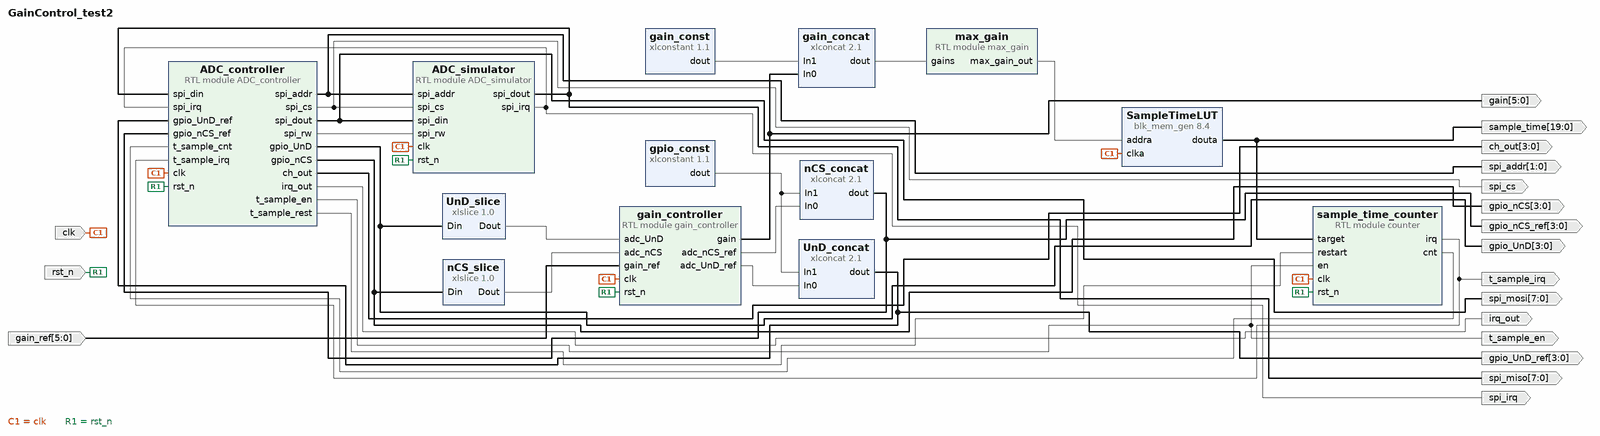
[diagram p0: block diagram of the top level]
# Vivado block design GainControl_test2, xczu3eg-sbva484-1-i, Vivado 2020.2
create_bd_design GainControl_test2

create_bd_port -dir O -from 3 -to 0 ch_out
create_bd_port -dir I -type clk clk
create_bd_port -dir O -from 5 -to 0 gain
create_bd_port -dir I -from 5 -to 0 gain_ref
create_bd_port -dir O -from 3 -to 0 gpio_UnD
create_bd_port -dir O -from 3 -to 0 gpio_UnD_ref
create_bd_port -dir O -from 3 -to 0 gpio_nCS
create_bd_port -dir O -from 3 -to 0 gpio_nCS_ref
create_bd_port -dir O irq_out
create_bd_port -dir I -type rst rst_n
create_bd_port -dir O -from 19 -to 0 sample_time
create_bd_port -dir O -from 1 -to 0 spi_addr
create_bd_port -dir O spi_cs
create_bd_port -dir O spi_irq
create_bd_port -dir O -from 7 -to 0 spi_miso
create_bd_port -dir O -from 7 -to 0 -type data spi_mosi
create_bd_port -dir O t_sample_en
create_bd_port -dir O t_sample_irq

create_bd_cell -type ip -vlnv xilinx.com:ip:blk_mem_gen:8.4 SampleTimeLUT
set_property -dict [list \
  CONFIG.Coe_File ../../../../../../../../src/sample_time_lut_data.coe \
  CONFIG.Enable_32bit_Address false \
  CONFIG.Enable_A Always_Enabled \
  CONFIG.Fill_Remaining_Memory_Locations true \
  CONFIG.Load_Init_File true \
  CONFIG.Memory_Type Single_Port_ROM \
  CONFIG.Port_A_Write_Rate 0 \
  CONFIG.Register_PortA_Output_of_Memory_Primitives true \
  CONFIG.Remaining_Memory_Locations F \
  CONFIG.Use_RSTA_Pin false \
  CONFIG.Write_Depth_A 64 \
  CONFIG.Write_Width_A 20 \
  CONFIG.use_bram_block Stand_Alone \
] [get_bd_cells SampleTimeLUT]
create_bd_cell -type ip -vlnv xilinx.com:ip:xlconcat:2.1 UnD_concat
set_property -dict {CONFIG.IN1_WIDTH 3 CONFIG.NUM_PORTS 2} [get_bd_cells UnD_concat]
create_bd_cell -type ip -vlnv xilinx.com:ip:xlslice:1.0 UnD_slice
set_property -dict {CONFIG.DIN_WIDTH 4} [get_bd_cells UnD_slice]
create_bd_cell -type ip -vlnv xilinx.com:ip:xlconcat:2.1 gain_concat
set_property -dict {CONFIG.IN0_WIDTH 6 CONFIG.IN1_WIDTH 18 CONFIG.NUM_PORTS 2} [get_bd_cells gain_concat]
create_bd_cell -type ip -vlnv xilinx.com:ip:xlconstant:1.1 gain_const
set_property -dict {CONFIG.CONST_VAL 0 CONFIG.CONST_WIDTH 18} [get_bd_cells gain_const]
create_bd_cell -type module -reference gain_controller gain_controller
create_bd_cell -type ip -vlnv xilinx.com:ip:xlconstant:1.1 gpio_const
set_property -dict {CONFIG.CONST_VAL 0 CONFIG.CONST_WIDTH 3} [get_bd_cells gpio_const]
create_bd_cell -type module -reference max_gain max_gain
create_bd_cell -type ip -vlnv xilinx.com:ip:xlconcat:2.1 nCS_concat
set_property -dict {CONFIG.IN1_WIDTH 3 CONFIG.NUM_PORTS 2} [get_bd_cells nCS_concat]
create_bd_cell -type ip -vlnv xilinx.com:ip:xlslice:1.0 nCS_slice
set_property -dict {CONFIG.DIN_WIDTH 4} [get_bd_cells nCS_slice]
create_bd_cell -type module -reference counter sample_time_counter
set_property -dict {CONFIG.n_bits 20} [get_bd_cells sample_time_counter]
create_bd_cell -type module -reference ADC_controller ADC_controller
create_bd_cell -type module -reference ADC_simulator ADC_simulator

# ---- connections ----

connect_bd_net -net ADC_controller_0_ch_out [get_bd_pins ADC_controller/ch_out] [get_bd_ports ch_out]
connect_bd_net -net ADC_controller_0_gpio_UnD [get_bd_pins ADC_controller/gpio_UnD] [get_bd_pins UnD_slice/Din] [get_bd_ports gpio_UnD]
connect_bd_net -net ADC_controller_0_gpio_nCS [get_bd_pins ADC_controller/gpio_nCS] [get_bd_pins nCS_slice/Din] [get_bd_ports gpio_nCS]
connect_bd_net -net ADC_controller_0_irq_out [get_bd_pins ADC_controller/irq_out] [get_bd_ports irq_out]
connect_bd_net -net ADC_controller_0_spi_addr [get_bd_pins ADC_controller/spi_addr] [get_bd_ports spi_addr] [get_bd_pins ADC_simulator/spi_addr]
connect_bd_net -net ADC_controller_0_spi_cs [get_bd_pins ADC_controller/spi_cs] [get_bd_ports spi_cs] [get_bd_pins ADC_simulator/spi_cs]
connect_bd_net -net ADC_controller_0_spi_dout [get_bd_pins ADC_controller/spi_dout] [get_bd_ports spi_mosi] [get_bd_pins ADC_simulator/spi_din]
connect_bd_net -net ADC_controller_0_spi_rw [get_bd_pins ADC_controller/spi_rw] [get_bd_pins ADC_simulator/spi_rw]
connect_bd_net [get_bd_pins ADC_controller/t_sample_en] [get_bd_pins sample_time_counter/en] [get_bd_ports t_sample_en]
connect_bd_net [get_bd_pins ADC_controller/t_sample_rest] [get_bd_pins sample_time_counter/restart]
connect_bd_net -net ADC_simulator_0_spi_dout1 [get_bd_pins ADC_simulator/spi_dout] [get_bd_ports spi_miso] [get_bd_pins ADC_controller/spi_din]
connect_bd_net -net ADC_simulator_0_spi_irq1 [get_bd_pins ADC_simulator/spi_irq] [get_bd_ports spi_irq] [get_bd_pins ADC_controller/spi_irq]
connect_bd_net [get_bd_pins SampleTimeLUT/douta] [get_bd_pins sample_time_counter/target] [get_bd_ports sample_time]
connect_bd_net [get_bd_pins UnD_slice/Dout] [get_bd_pins gain_controller/adc_UnD]
connect_bd_net -net clk_0_1 [get_bd_ports clk] \
  [get_bd_pins gain_controller/clk] [get_bd_pins sample_time_counter/clk] [get_bd_pins SampleTimeLUT/clka] \
  [get_bd_pins ADC_controller/clk] [get_bd_pins ADC_simulator/clk]
connect_bd_net -net curr_gain_1 [get_bd_pins gain_concat/dout] [get_bd_pins max_gain/gains]
connect_bd_net -net gain_controller_0_adc_UnD_ref [get_bd_pins gain_controller/adc_UnD_ref] [get_bd_pins UnD_concat/In0]
connect_bd_net -net gain_controller_0_adc_nCS_ref [get_bd_pins gain_controller/adc_nCS_ref] [get_bd_pins nCS_concat/In0]
connect_bd_net -net gain_controller_0_gain [get_bd_pins gain_controller/gain] [get_bd_ports gain] [get_bd_pins gain_concat/In0]
connect_bd_net -net gain_ref_0_1 [get_bd_ports gain_ref] [get_bd_pins gain_controller/gain_ref]
connect_bd_net -net gpio_UnD_ref_1 [get_bd_pins UnD_concat/dout] [get_bd_ports gpio_UnD_ref] [get_bd_pins ADC_controller/gpio_UnD_ref]
connect_bd_net -net gpio_nCS_ref_1 [get_bd_pins nCS_concat/dout] [get_bd_ports gpio_nCS_ref] [get_bd_pins ADC_controller/gpio_nCS_ref]
connect_bd_net -net max_gain_0_max_gain_out [get_bd_pins max_gain/max_gain_out] [get_bd_pins SampleTimeLUT/addra]
connect_bd_net [get_bd_pins nCS_slice/Dout] [get_bd_pins gain_controller/adc_nCS]
connect_bd_net -net rst_n_0_1 [get_bd_ports rst_n] \
  [get_bd_pins gain_controller/rst_n] [get_bd_pins sample_time_counter/rst_n] [get_bd_pins ADC_controller/rst_n] \
  [get_bd_pins ADC_simulator/rst_n]
connect_bd_net [get_bd_pins sample_time_counter/cnt] [get_bd_pins ADC_controller/t_sample_cnt]
connect_bd_net [get_bd_pins sample_time_counter/irq] [get_bd_ports t_sample_irq] [get_bd_pins ADC_controller/t_sample_irq]
connect_bd_net -net xlconstant_0_dout [get_bd_pins gpio_const/dout] [get_bd_pins nCS_concat/In1] [get_bd_pins UnD_concat/In1]
connect_bd_net -net xlconstant_1_dout [get_bd_pins gain_const/dout] [get_bd_pins gain_concat/In1]

validate_bd_design
save_bd_design
